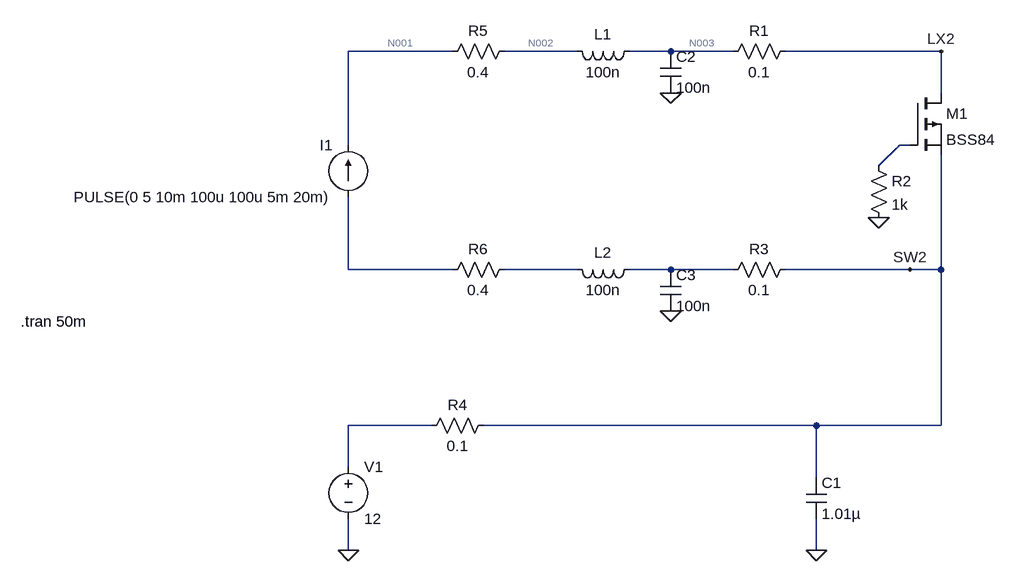
[diagram p0: schematic LX_Overcurrent_Threshold_Test.asc]
LX_Overcurrent_Threshold_Test.asc, the LTspice schematic file:
Version 4
SHEET 1 1400 932
WIRE -96 112 -256 112
WIRE 96 112 -16 112
WIRE 240 112 176 112
WIRE 336 112 240 112
WIRE 656 112 416 112
WIRE 656 176 656 112
WIRE -256 256 -256 112
WIRE 608 256 592 256
WIRE 560 288 592 256
WIRE -256 448 -256 336
WIRE -96 448 -256 448
WIRE 96 448 -16 448
WIRE 240 448 176 448
WIRE 336 448 240 448
WIRE 608 448 416 448
WIRE 656 448 656 272
WIRE 656 448 608 448
WIRE -128 688 -256 688
WIRE 464 688 -48 688
WIRE 656 688 656 448
WIRE 656 688 464 688
WIRE -256 752 -256 688
WIRE 464 768 464 688
WIRE -256 880 -256 832
WIRE 464 880 464 832
FLAG 464 880 0
FLAG -256 880 0
FLAG 240 512 0
FLAG 240 176 0
FLAG 560 368 0
FLAG 656 112 LX2
FLAG 608 448 SW2
SYMBOL current -256 336 R180
WINDOW 0 24 80 Left 2
WINDOW 3 24 0 Left 2
WINDOW 123 0 0 Left 0
WINDOW 39 0 0 Left 0
SYMATTR InstName I1
SYMATTR Value PULSE(0 5 10m 100u 100u 5m 20m)
SYMBOL ind 192 96 R90
WINDOW 0 5 56 VBottom 2
WINDOW 3 32 56 VTop 2
SYMATTR InstName L1
SYMATTR Value 100n
SYMBOL res 432 96 R90
WINDOW 0 0 56 VBottom 2
WINDOW 3 32 56 VTop 2
SYMATTR InstName R1
SYMATTR Value 0.1
SYMBOL cap 448 768 R0
SYMATTR InstName C1
SYMATTR Value 1.01µ
SYMBOL ind 192 432 R90
WINDOW 0 5 56 VBottom 2
WINDOW 3 32 56 VTop 2
SYMATTR InstName L2
SYMATTR Value 100n
SYMBOL res 432 432 R90
WINDOW 0 0 56 VBottom 2
WINDOW 3 32 56 VTop 2
SYMATTR InstName R3
SYMATTR Value 0.1
SYMBOL voltage -256 736 R0
WINDOW 123 0 0 Left 0
WINDOW 39 0 0 Left 0
SYMATTR InstName V1
SYMATTR Value 12
SYMBOL cap 224 112 R0
SYMATTR InstName C2
SYMATTR Value 100n
SYMBOL cap 224 448 R0
SYMATTR InstName C3
SYMATTR Value 100n
SYMBOL pmos 608 176 R0
SYMATTR InstName M1
SYMATTR Value BSS84
SYMBOL res 544 272 R0
SYMATTR InstName R2
SYMATTR Value 1k
SYMBOL res -32 672 R90
WINDOW 0 0 56 VBottom 2
WINDOW 3 32 56 VTop 2
SYMATTR InstName R4
SYMATTR Value 0.1
SYMBOL res 0 96 R90
WINDOW 0 0 56 VBottom 2
WINDOW 3 32 56 VTop 2
SYMATTR InstName R5
SYMATTR Value 0.4
SYMBOL res 0 432 R90
WINDOW 0 0 56 VBottom 2
WINDOW 3 32 56 VTop 2
SYMATTR InstName R6
SYMATTR Value 0.4
TEXT -760 528 Left 2 !.tran 50m

The netlist it stands for:
* LX_Overcurrent_Threshold_Test.asc
I1 N005 N001 PULSE(0 5 10m 100u 100u 5m 20m)
L1 N003 N002 100n
R1 LX2 N003 0.1
C1 SW2 0 1.01µ
L2 N007 N006 100n
R3 SW2 N007 0.1
V1 N008 0 12
C2 N003 0 100n
C3 N007 0 100n
M1 LX2 N004 SW2 SW2 BSS84
R2 N004 0 1k
R4 SW2 N008 0.1
R5 N002 N001 0.4
R6 N006 N005 0.4
.model NMOS NMOS
.model PMOS PMOS
.lib standard.mos
.tran 50m
.backanno
.end

* Results of the author's LTspice run, read from the files saved beside the schematic
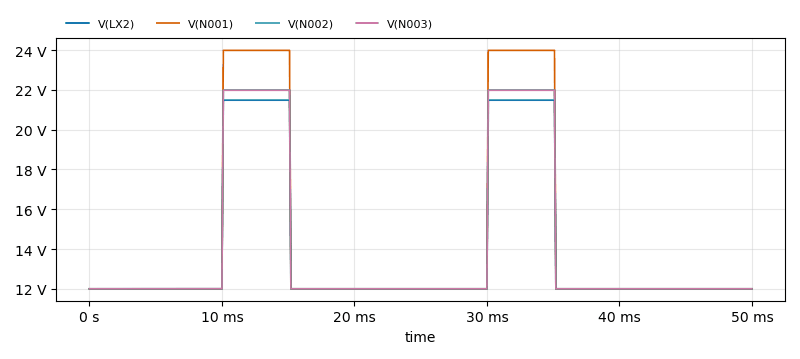
[diagram p1: Transient Analysis of LX_Overcurrent_Threshold_Test.asc, plotted from the saved traces]
* Transient Analysis, 1 run:
*   V(LX2): min 12 V, max 21.48 V, average 13.94 V, rms 14.45 V, last 12 V
*   V(N001): min 12 V, max 23.99 V, average 14.45 V, rms 15.23 V, last 12 V
*   V(N002): min 12 V, max 21.99 V, average 14.04 V, rms 14.6 V, last 12 V
*   V(N003): min 12 V, max 21.98 V, average 14.04 V, rms 14.6 V, last 12 V